# Altium schematic sheet OTHERS.SchDoc
size A4
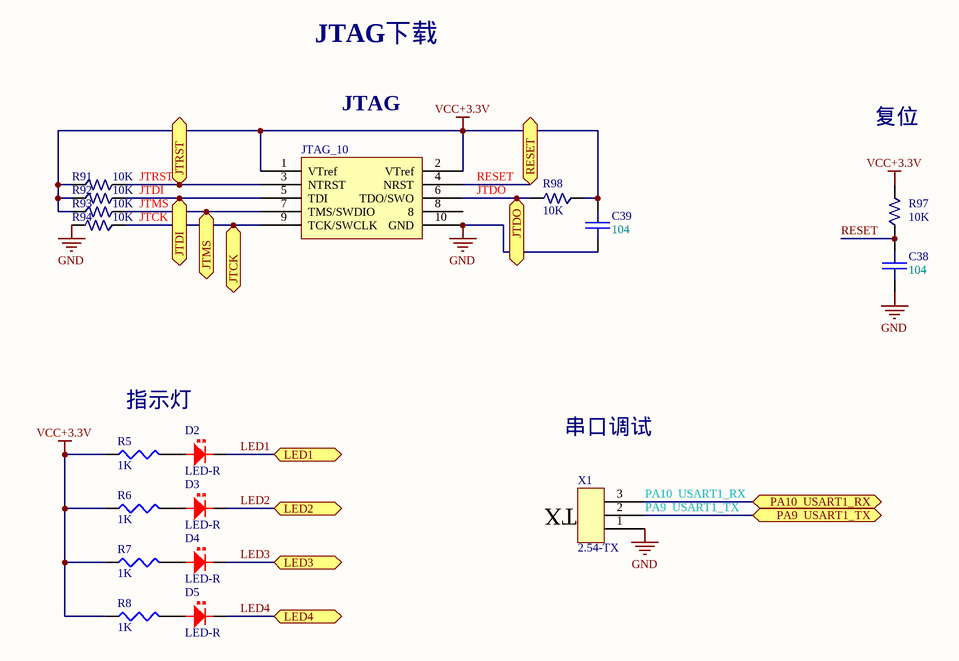
[diagram p0: OTHERS.SchDoc]

## Parts
C38  104  [0603]
C39  104  [0603]
D2  LED-R  [LED-0603]
D3  LED-R  [LED-0603]
D4  LED-R  [LED-0603]
D5  LED-R  [LED-0603]
JTAG  JTAG_10  [JTAG_10]
R5  1K  [0603]
R6  1K  [0603]
R7  1K  [0603]
R8  1K  [0603]
R91  10K  [0603]
R92  10K  [0603]
R93  10K  [0603]
R94  10K  [0603]
R97  10K  [0603]
R98  10K  [0603]
X1  2.54-TX  [2.54-TX]

## Ports
JTCK, JTDI, JTDO, JTMS, JTRST, LED1, LED2, LED3, LED4, PA9  USART1_TX, PA10  USART1_RX, RESET

## Nets
GND: C38.1 C39.2 JTAG.10(GND) R94.2 X1.1
VCC+3.3V: C39.1 JTAG.1(VTref) JTAG.2(VTref) R5.1 R6.1 R7.1 R8.1 R91.1 R92.1 R93.1 R97.2 R98.1
JTCK: JTAG.9(TCK/SWCLK) R94.1 ; port JTCK
JTDI: JTAG.5(TDI) R92.2 ; port JTDI
JTDO: JTAG.6(TDO/SWO) R98.2 ; port JTDO
JTMS: JTAG.7(TMS/SWDIO) R93.2 ; port JTMS
JTRST: JTAG.3(NTRST) R91.2 ; port JTRST
LED1: D2.2 ; port LED1
LED2: D3.2 ; port LED2
LED3: D4.2 ; port LED3
LED4: D5.2 ; port LED4
PA9  USART1_TX: X1.2 ; port PA9  USART1_TX
PA10  USART1_RX: X1.3 ; port PA10  USART1_RX
RESET: C38.2 JTAG.4(NRST) R97.1 ; port RESET
NetD2_1: D2.1 R5.2
NetD3_1: D3.1 R6.2
NetD4_1: D4.1 R7.2
NetD5_1: D5.1 R8.2

Not connected (* = marked no-connect by the designer): JTAG 8

## Notes on the sheet
- JTAG下载
- JTAG
- 复位
- 指示灯
- 串口调试
- (in symbol 2.54-TX) TX

## Library data of the parts
C38 C39 = CAP: 陶瓷电容
D2-D5 = LED-RED: 红色LED
R5-R8 = RES1
R91-R94 R97 R98 = RES-1%: 高精度电阻